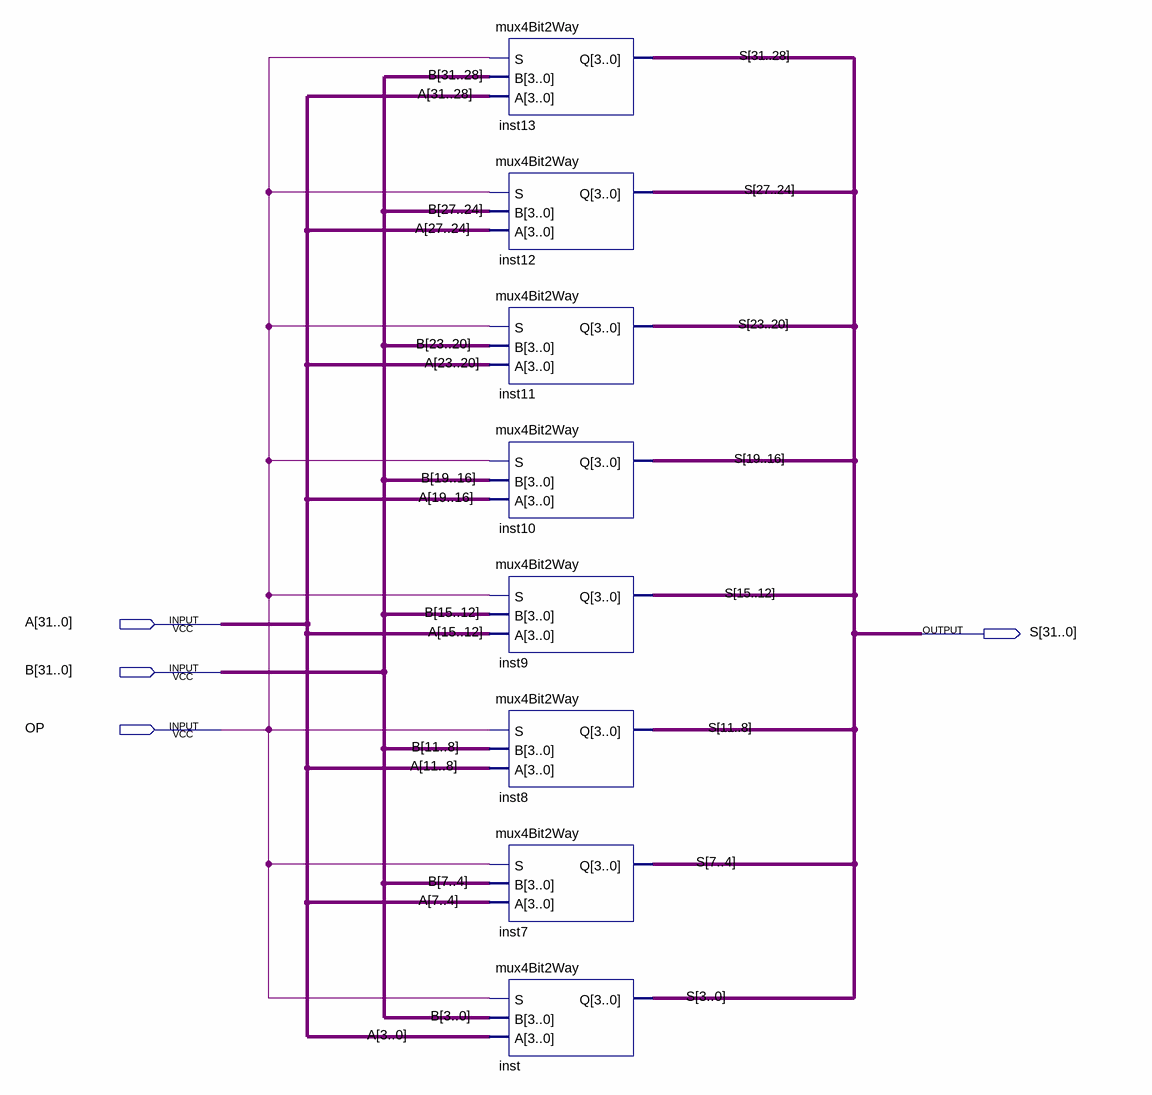
[diagram p0: schematic sheet]
// Quartus schematic mux32Bit2Way.bdf as structural Verilog: 8 symbols, 4 pins
module mux32Bit2Way (
  input  [31:0] A,
  input  [31:0] B,
  input  OP,
  output [31:0] S
);

  mux4Bit2Way inst13 (.S(OP), .B(B[31:28]), .A(A[31:28]), .Q(S[31:28]));
  mux4Bit2Way inst12 (.S(OP), .B(B[27:24]), .A(A[27:24]), .Q(S[27:24]));
  mux4Bit2Way inst11 (.S(OP), .B(B[23:20]), .A(A[23:20]), .Q(S[23:20]));
  mux4Bit2Way inst10 (.S(OP), .B(B[19:16]), .A(A[19:16]), .Q(S[19:16]));
  mux4Bit2Way inst9 (.S(OP), .B(B[15:12]), .A(A[15:12]), .Q(S[15:12]));
  mux4Bit2Way inst8 (.S(OP), .B(B[11:8]), .A(A[11:8]), .Q(S[11:8]));
  mux4Bit2Way inst7 (.S(OP), .B(B[7:4]), .A(A[7:4]), .Q(S[7:4]));
  mux4Bit2Way inst (.S(OP), .B(B[3:0]), .A(A[3:0]), .Q(S[3:0]));
endmodule
